# EAGLE design Pi-ic880a (EAGLE 8.4.2)
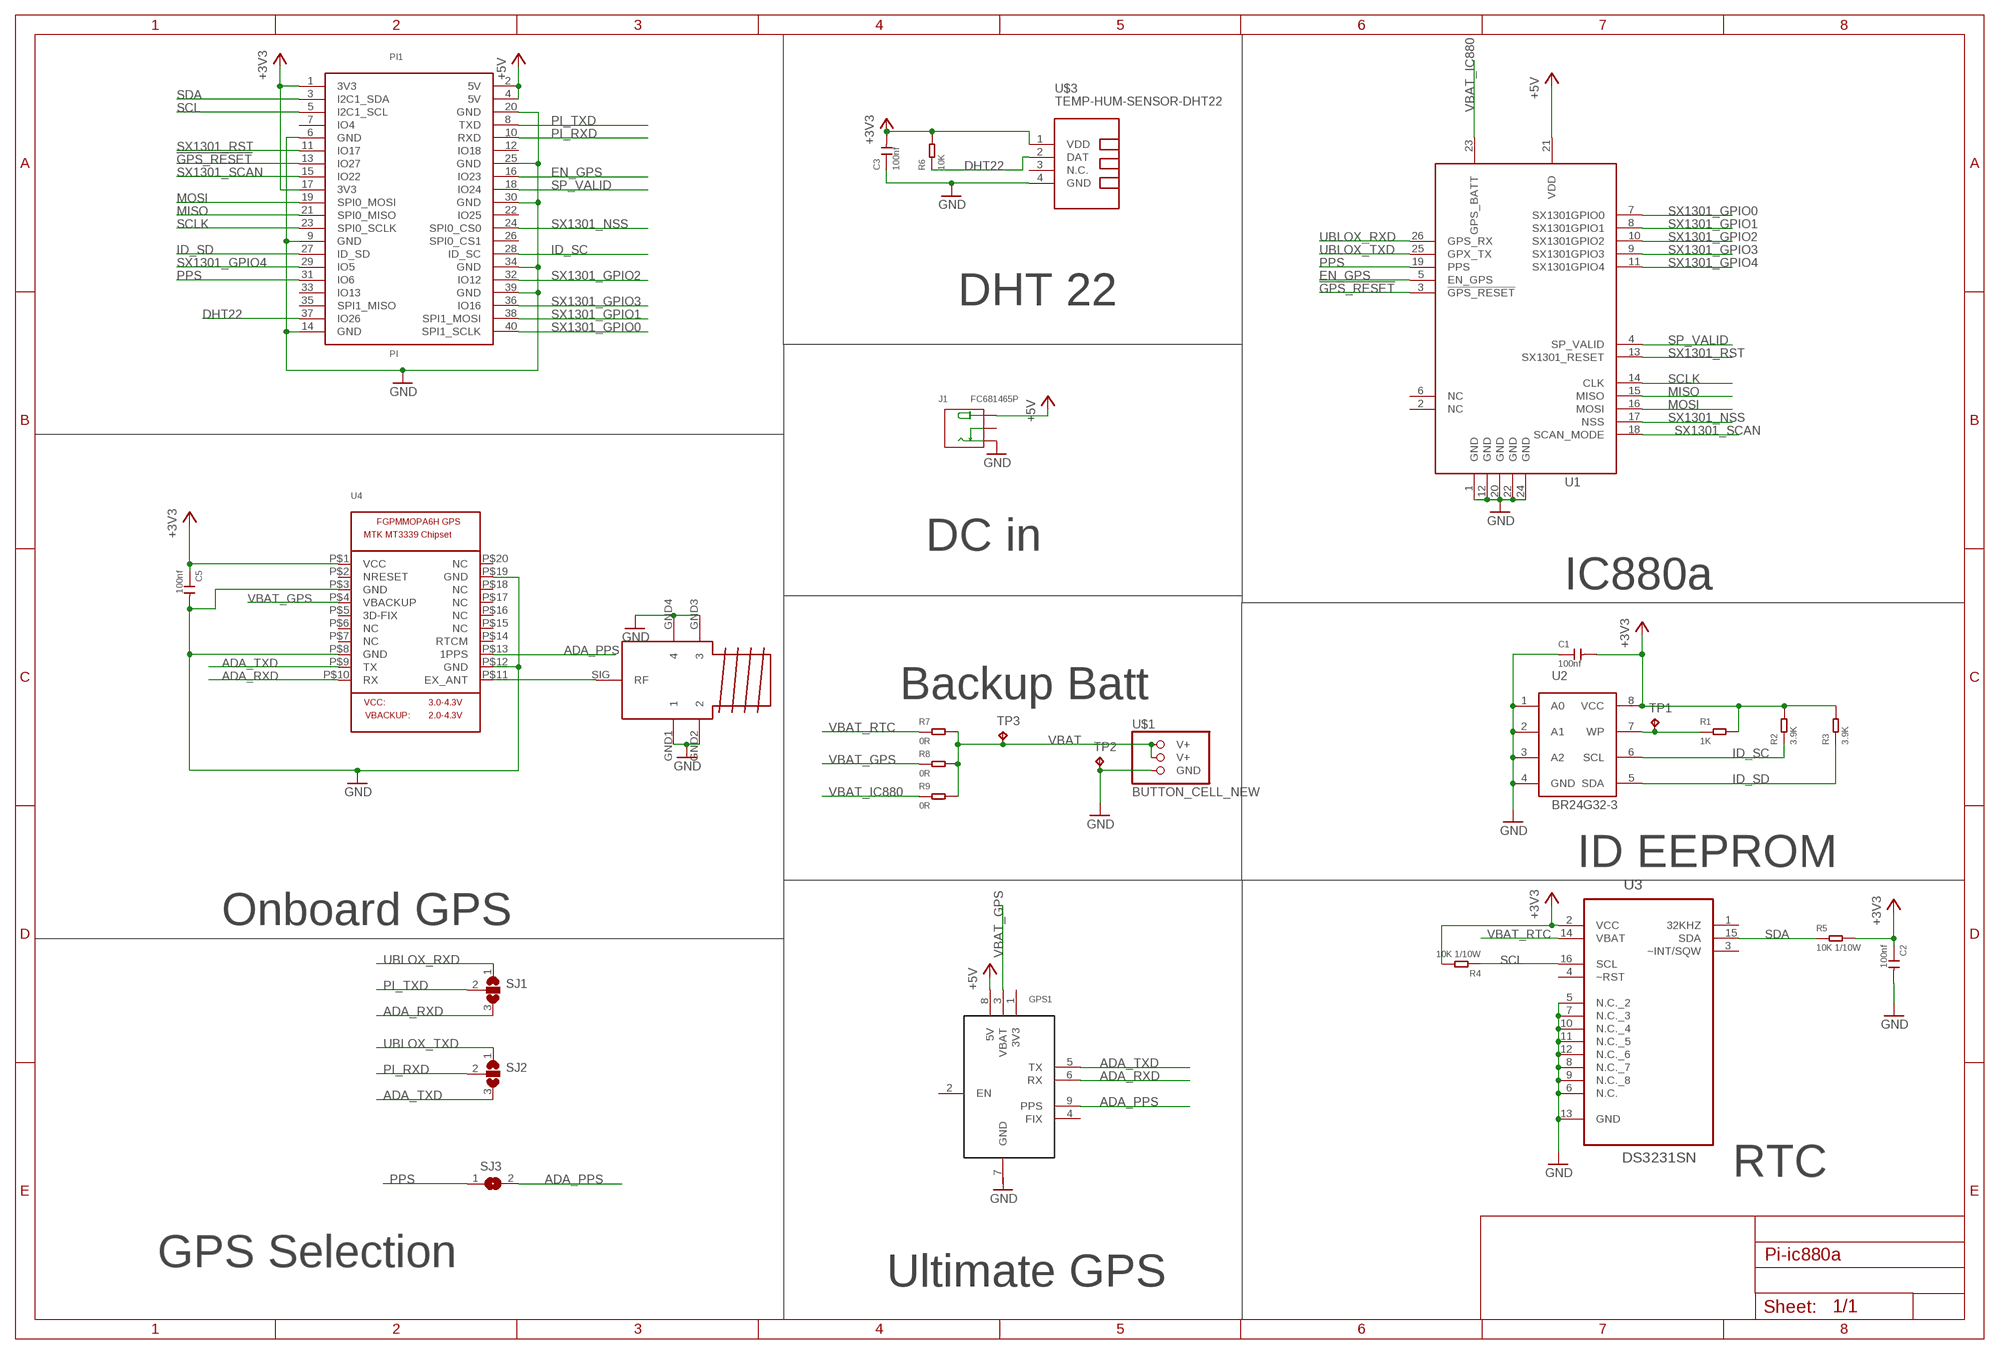
[diagram p0: schematic, sheet 1]

## Parts
C1  100nf  CERAMIC-100NF-50V-10%-X7R(0603)  [C0603]
C2  100nf  CERAMIC-100NF-50V-10%-X7R(0603)  [C0603]
C3  100nf  CERAMIC-100PF-50V-5%-NPO(0603)  [C0603]
C5  100nf  CERAMIC-100NF-50V-10%-X7R(0603)  [C0603]
GPS1  ULTIMATE-GPS  [ULTIMATE-GPS]
J1  FC681465P  [FC681465P]
PI1  PI  [PI]
R1  1K  SMD-RES-1K-1%-1/10W(0603)  [R0603]
R2  3.9K  SMD-RES-3.9K-5%-1/10W(0603)  [R0603]
R3  3.9K  SMD-RES-3.9K-5%-1/10W(0603)  [R0603]
R4  10K 1/10W  SMD-RES-10K-5%-1/10W(0603)  [R0603]
R5  10K 1/10W  SMD-RES-10K-5%-1/10W(0603)  [R0603]
R6  10K  SMD-RES-10K-1%-1/10W(0603)  [R0603]
R7  0R  SMD-RES-0R-5%-1/10W(0603)  [R0603]
R8  0R  SMD-RES-0R-5%-1/10W(0603)  [R0603]
R9  0R  SMD-RES-0R-5%-1/10W(0603)  [R0603]
SJ1  SJ2W  [SJ_2]
SJ2  SJ2W  [SJ_2]
SJ3  SJ  [SJ]
TP1  TPB2,54  [B2,54]
TP2  TPB2,54  [B2,54]
TP3  TPB2,54  [B2,54]
U1  IC880A  [IC880A]
U2  BR24G32-3  [SOP8]
U3  DS3231SN  [SOIC127P1032X265-16N]
U4  GPS_FGPMMOPA6H  [FGPMMOPA6H]
U$1  BUTTON_CELL_NEW  [CR2016]
U$2  SMATH  [SMA]
U$3  TEMP-HUM-SENSOR-DHT22  [TEMP-HUM-SENSOR-DHT22]

## Nets
!GPS_RESET: PI1.13(IO27) U1.3(!GPS_RESET)
+3V3: C1.2 C2.1 C3.2 C5.1 PI1.1(3V3) PI1.17(3V3) R1.2 R2.2 R3.2 R4.2 R5.2 R6.2 U2.8(VCC) U3.2(VCC) U4.P$1(VCC) U$3.1(VDD)
+5V: GPS1.8(5V) J1.1(+) PI1.2(5V) PI1.4(5V) U1.21(VDD)
ADA_PPS: GPS1.9(PPS) SJ3.2 U4.P$13(1PPS)
ADA_RXD: GPS1.6(RX) SJ1.3 U4.P$10(RX)
ADA_TXD: GPS1.5(TX) SJ2.3 U4.P$9(TX)
DHT22: PI1.37(IO26) R6.1 U$3.2(DAT)
EN_GPS: PI1.16(IO23) U1.5(EN_GPS)
GND: C1.1 C2.2 C3.1 C5.2 J1.3(-) PI1.6(GND) PI1.9(GND) PI1.14(GND) PI1.20(GND) PI1.25(GND) PI1.30(GND) PI1.34(GND) PI1.39(GND) TP2.TP U1.1(GND) U1.12(GND) U1.20(GND) U1.22(GND) U1.24(GND) U2.1(A0) U2.2(A1) U2.3(A2) U2.4(GND) U3.5(N.C._2) U3.6(N.C.) U3.7(N.C._3) U3.8(N.C._7) U3.9(N.C._8) U3.10(N.C._4) U3.11(N.C._5) U3.12(N.C._6) U3.13(GND) U4.P$3(GND) U4.P$8(GND) U4.P$12(GND) U4.P$19(GND) U$1.GND U$2.GND1 U$2.GND2 U$2.GND3 U$2.GND4 U$3.4(GND)
GPS_ANT: U4.P$11(EX_ANT) U$2.SIG(RF)
ID_SC: PI1.28(ID_SC) R2.1 U2.6(SCL)
ID_SD: PI1.27(ID_SD) R3.1 U2.5(SDA)
MISO: PI1.21(SPI0_MISO) U1.15(MISO)
MOSI: PI1.19(SPI0_MOSI) U1.16(MOSI)
PI_RXD: PI1.10(RXD) SJ2.2
PI_TXD: PI1.8(TXD) SJ1.2
PPS: PI1.31(IO6) SJ3.1 U1.19(PPS)
SCL: PI1.5(I2C1_SCL) R4.1 U3.16(SCL)
SCLK: PI1.23(SPI0_SCLK) U1.14(CLK)
SDA: PI1.3(I2C1_SDA) R5.1 U3.15(SDA)
SP_VALID: PI1.18(IO24) U1.4(SP_VALID)
SX1301_GPIO0: PI1.40(SPI1_SCLK) U1.7(SX1301GPIO0)
SX1301_GPIO1: PI1.38(SPI1_MOSI) U1.8(SX1301GPIO1)
SX1301_GPIO2: PI1.32(IO12) U1.10(SX1301GPIO2)
SX1301_GPIO3: PI1.36(IO16) U1.9(SX1301GPIO3)
SX1301_GPIO4: PI1.29(IO5) U1.11(SX1301GPIO4)
SX1301_NSS: PI1.24(SPI0_CS0) U1.17(NSS)
SX1301_RST: PI1.11(IO17) U1.13(SX1301_RESET)
SX1301_SCAN: PI1.15(IO22) U1.18(SCAN_MODE)
UBLOX_RXD: SJ1.1 U1.26(GPS_RX)
UBLOX_TXD: SJ2.1 U1.25(GPX_TX)
VBAT: R7.2 R8.2 R9.2 TP3.TP U$1.V+@1(V+) U$1.V+@2(V+)
VBAT_GPS: GPS1.3(VBAT) R8.1 U4.P$4(VBACKUP)
VBAT_IC880: R9.1 U1.23(GPS_BATT)
VBAT_RTC: R7.1 U3.14(VBAT)
WP: R1.1 TP1.TP U2.7(WP)
Unconnected: GPS1.2(EN) GPS1.4(FIX) J1.2(CDN) PI1.7(IO4) PI1.12(IO18) PI1.22(IO25) PI1.26(SPI0_CS1) PI1.33(IO13) PI1.35(SPI1_MISO) U1.2(NC) U1.6(NC) U3.1(32KHZ) U3.3(~INT/SQW) U3.4(~RST) U4.P$2(NRESET) U4.P$5(3D-FIX) U4.P$6(NC) U4.P$7(NC) U4.P$14(RTCM) U4.P$15(NC) U4.P$16(NC) U4.P$17(NC) U4.P$18(NC) U4.P$20(NC) U$3.3(N.C.)

## Notes on the sheet
- DHT 22
- DC in
- IC880a
- Backup Batt
- ID EEPROM
- Onboard GPS
- RTC
- GPS Selection
- Ultimate GPS

## Power pins joined to a net without a drawn wire
3V3: GPS1.1(3V3)
GND: GPS1.7(GND)

## Library data of the parts
C1 C2 C5 = Seeed-Capacitor-2016:CERAMIC-100NF-50V-10%-X7R(0603): 302010138; MPN: CC0603KRX7R9BB104
C3 = Seeed-Capacitor:CERAMIC-100PF-50V-5%-NPO(0603): 302010076; MPN: CC0603JRNPO9BN101; VALUE: 100pf
GPS1 = fruit-parts:ULTIMATE-GPS
J1 = farnell-parts:FC681465P
PI1 = fruit-parts:PI
R1 = Seeed-Resistor-2016:SMD-RES-1K-1%-1/10W(0603): 301010298; MPN: RC0603FR-071KL
R2 R3 = Seeed-Resistor-2016:SMD-RES-3.9K-5%-1/10W(0603): 301010101; MPN: RC0603JR-073K9L
R4 R5 = Seeed-Resistor-2016:SMD-RES-10K-5%-1/10W(0603): 301010293; MPN: RC0603JR-0710KL
R6 = Seeed-Resistor:SMD-RES-10K-1%-1/10W(0603): 301010299; MPN: RC0603FR-0710KL
R7-R9 = Seeed-Resistor:SMD-RES-0R-5%-1/10W(0603): 301010292; MPN: RC0603JR-070RL
SJ1 SJ2 = jumper:SJ2W: SMD solder JUMPER
SJ3 = jumper:SJ: SMD solder JUMPER
TP1-TP3 = testpad:TP: Test pad
U1 = fruit-parts:IC880A
U2 = farnell-parts:BR24G32-3: http://uk.farnell.com/rohm/br24g32fj-3gte2/serial-eeprom-32kbit-1mhz-sop/dp/2373743?MER=sy-me-pd-mi-alte
U3 = imported-parts:DS3231SN: Extremely Accurate I2C-Integrated RTC/TCXO/Crystal; MPN: DS3231SN#; OC_FARNELL: 1593292; OC_NEWARK: 68K3406; PACKAGE: SOIC-16; SUPPLIER: Maxim
U4 = fruit-parts:GPS_FGPMMOPA6H: GPS Module - MTK MT3339 Chipset, -165dBm sensitivity, 22 channels, 10Hz, auto-select external antenna options
U$1 = fruit-parts:BUTTON_CELL_NEW
U$2 = fruit-parts:SMA
U$3 = fruit-parts:TEMP-HUM-SENSOR-DHT22: DHT22 - digital humidity & temperature sensor Also known as: AM2302 AM2302 datasheet available here: http://akizukidenshi.com/download/ds/aosong/AM2302.pdf Click here to find device on ebay.com <http://www.ebay.com/sch/dht22+digital+sensor>

## Board
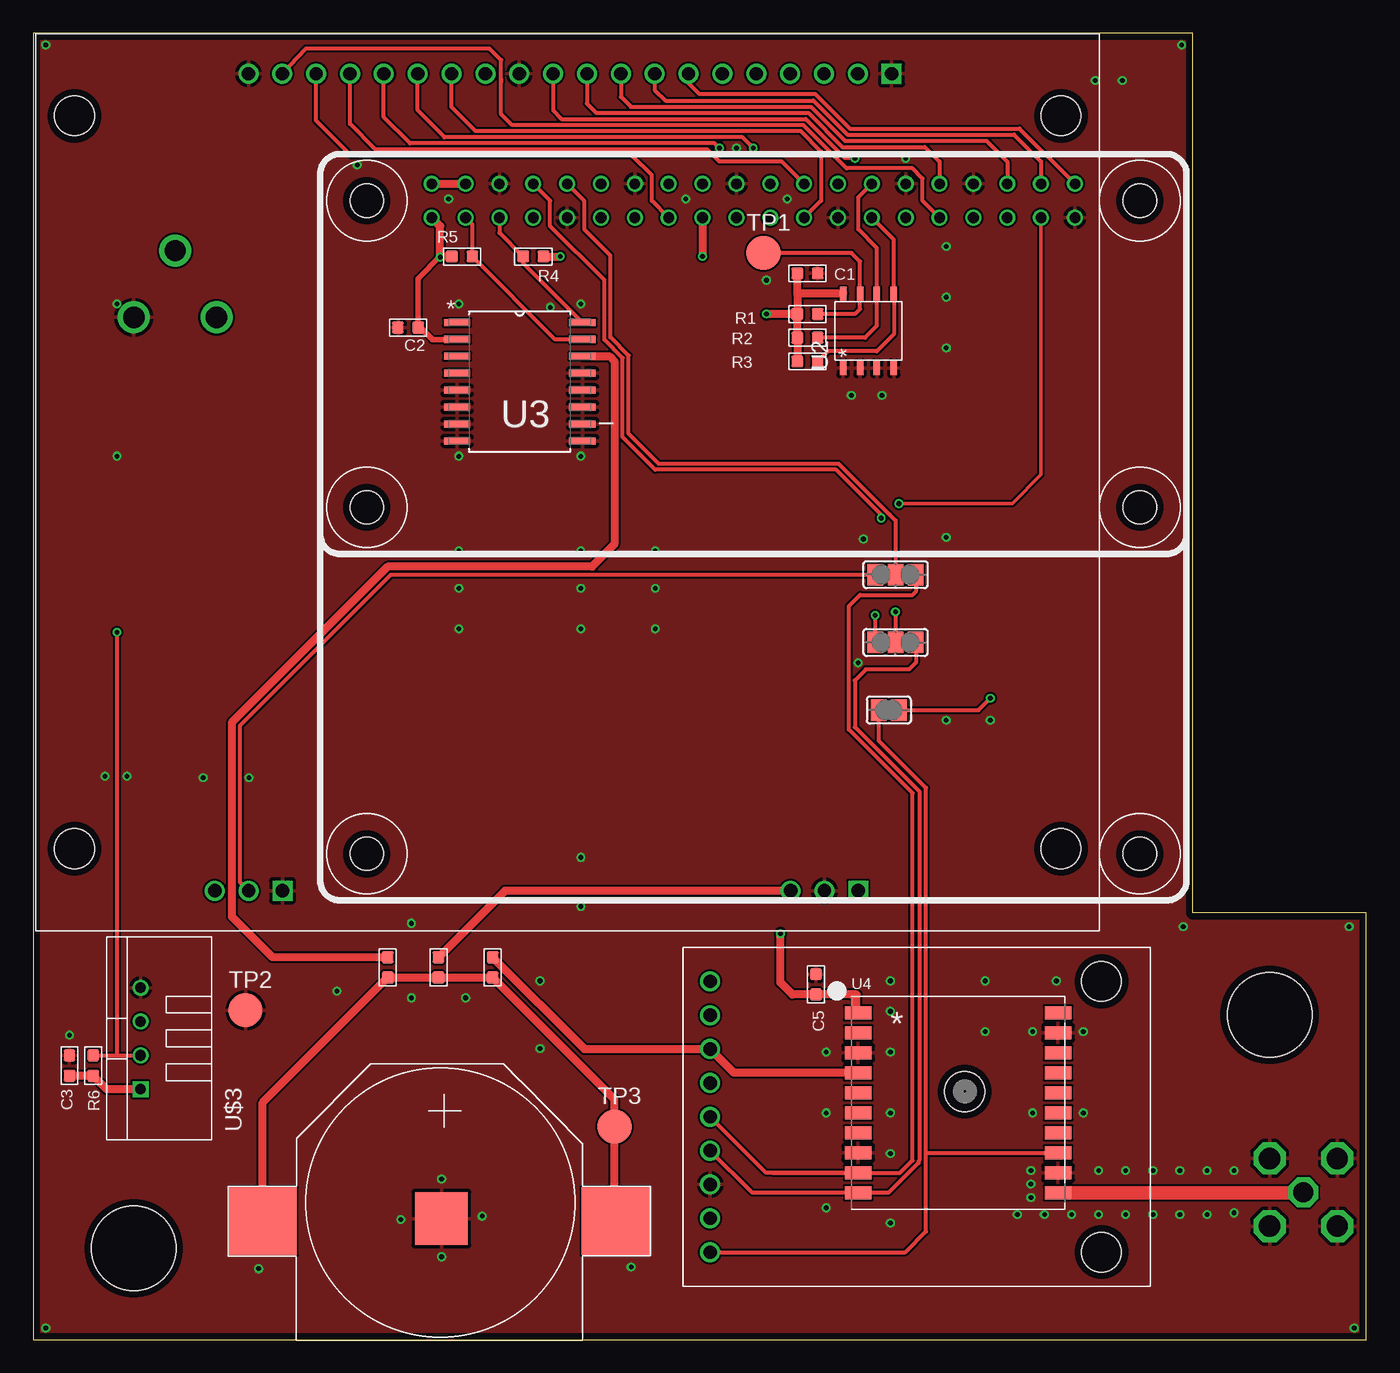
[diagram p1: board, top side]
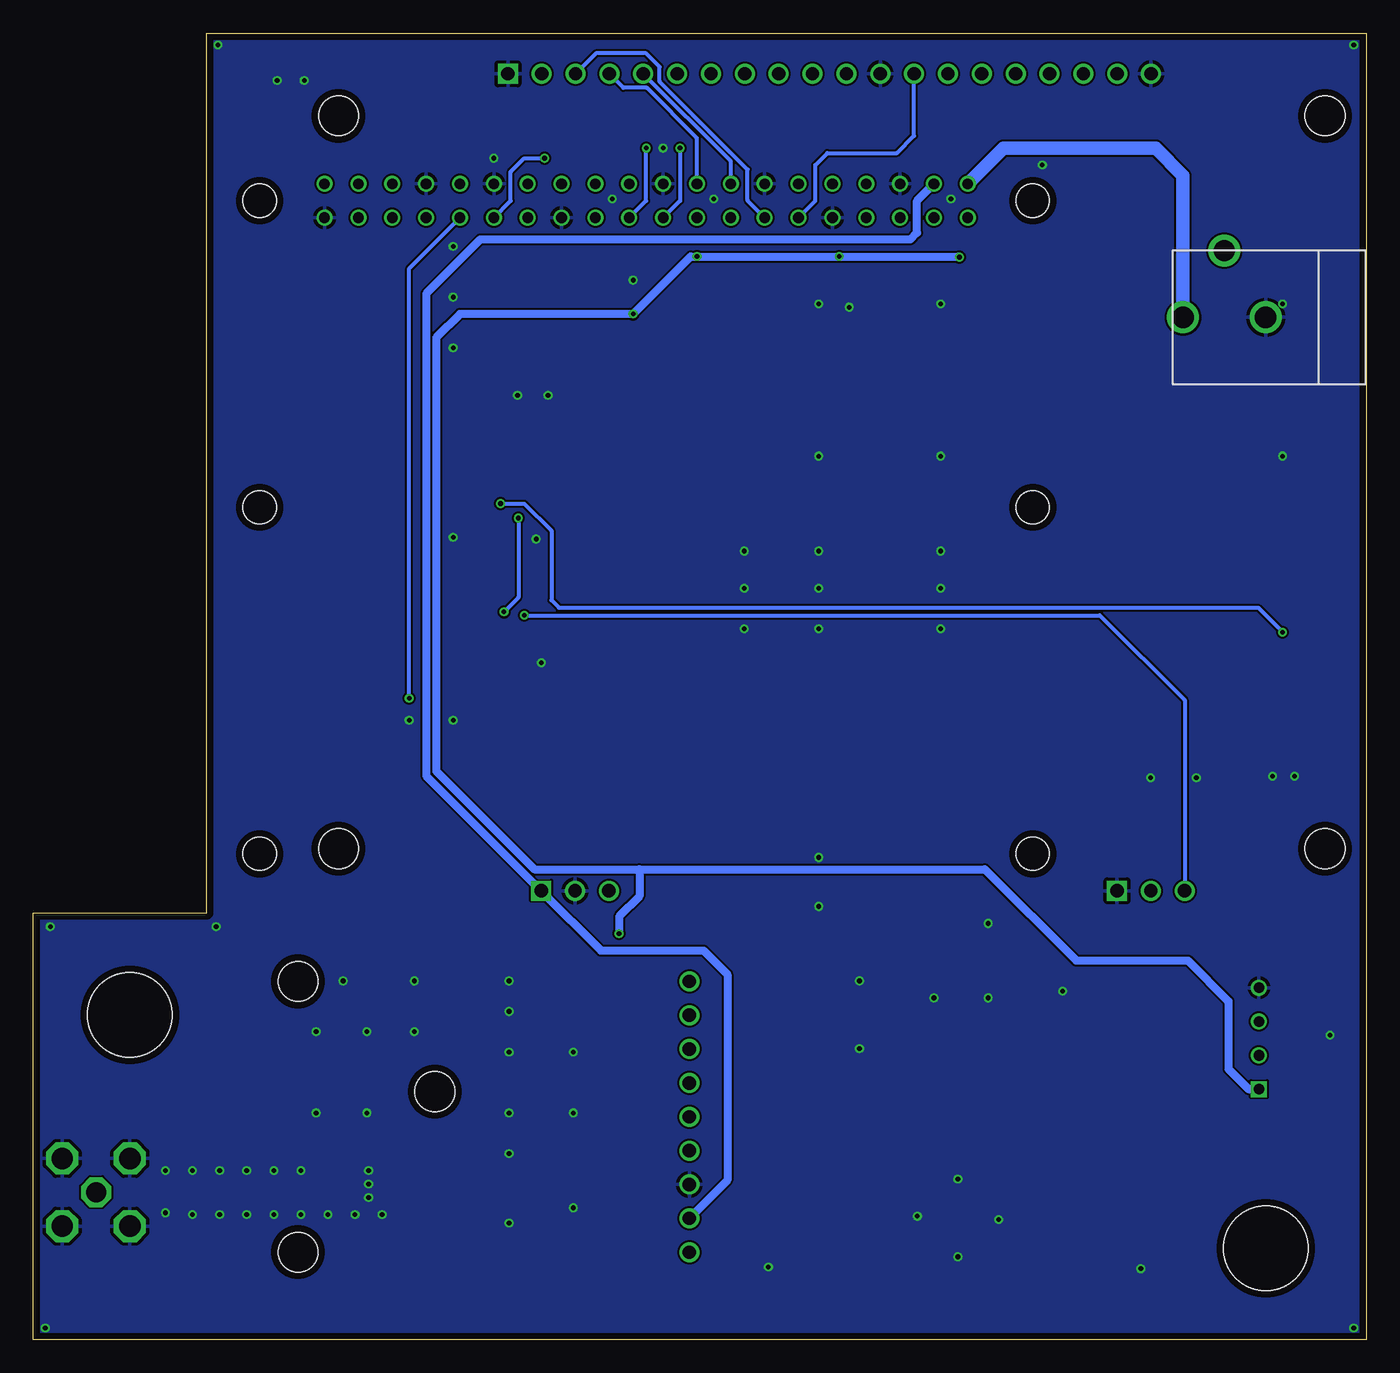
[diagram p2: board, bottom side, seen from below]

Size 100 x 98 mm. Coordinates in mm from the lower left corner, seen from the top.
Outline: 0,0 100,0 100,32 87,32 87,98 0,98 0,0
Copper layers (1*16): Top 0.035mm / dielectric 1.6mm / Bottom 0.035mm
Design rules "Elecrow_2-layer_PCB_eagle_rule": minimum track width 6mil, minimum drill 12mil, track to track 6mil, track to pad 6mil, pad to pad 6mil, via to via 8mil, smd to smd 0mil, copper to edge 20mil, drill to drill 10mil, minimum pad ring 6mil, minimum via ring 6mil, stop-mask expansion 0mil, vias tented up to drill 100mil, thermal gap 10mil
Holes 6.35 mm at 92.75,24.35 7.54,6.85

### Footprints (pad centres in the part's own frame; a part is rotated, then mirrored left to right if it is on the bottom)
C0603 = smd 0.889 x 0.889: 1 0,0.762; 2 0,-0.762
ULTIMATE-GPS = drill 1: 1 -10.16,-15.494; 2 -7.62,-15.494; 3 -5.08,-15.494; 4 -2.54,-15.494; 5 0,-15.494; 6 2.54,-15.494; 7 5.08,-15.494; 8 7.62,-15.494; 9 10.16,-15.494 | hole 3: -10.16,13.858; 10.16,13.858
FC681465P = drill 1.6: 1 6.2,0; 2 3.1,-5; 3 0,0
PI = drill 0.8: 1 -24.13,23.23; 2 -24.13,25.77; 3 -21.59,23.23; 4 -21.59,25.77; 5 -19.05,23.23; 6 -19.05,25.77; 7 -16.51,23.23; 8 -16.51,25.77; 9 -13.97,23.23; 10 -13.97,25.77; 11 -11.43,23.23; 12 -11.43,25.77; 13 -8.89,23.23; 14 -8.89,25.77; 15 -6.35,23.23; 16 -6.35,25.77; 17 -3.81,23.23; 18 -3.81,25.77; 19 -1.27,23.23; 20 -1.27,25.77; 21 1.27,23.23; 22 1.27,25.77; 23 3.81,23.23; 24 3.81,25.77; 25 6.35,23.23; 26 6.35,25.77; 27 8.89,23.23; 28 8.89,25.77; 29 11.43,23.23; 30 11.43,25.77; 31 13.97,23.23; 32 13.97,25.77; 33 16.51,23.23; 34 16.51,25.77; 35 19.05,23.23; 36 19.05,25.77; 37 21.59,23.23; 38 21.59,25.77; 39 24.13,23.23; 40 24.13,25.77 | hole 2.5: -29,24.5; 29,24.5; -29,1.5; 29,1.5; -29,-24.5; 29,-24.5
R0603 = smd 0.889 x 0.889: 1 0,0.762; 2 0,-0.762
SJ_2 = smd 1.168 x 1.6: 1 -1.524,0; 2 0,0; 3 1.524,0
SJ = smd 1.168 x 1.6: 1 -0.762,0; 2 0.762,0
B2,54 = smd 2.54 x 2.54: TP 0,0
IC880A = drill 1 square: 1 -24.3,-30.65; 21 -21.8,30.65; 24 21.4,30.65 | drill 1: 2 -21.76,-30.65; 3 -19.22,-30.65; 4 -16.68,-30.65; 5 -14.14,-30.65; 6 -11.6,-30.65; 7 -9.06,-30.65; 8 -6.52,-30.65; 9 -3.98,-30.65; 10 -1.44,-30.65; 11 1.1,-30.65; 12 3.64,-30.65; 13 6.18,-30.65; 14 8.72,-30.65; 15 11.26,-30.65; 16 13.8,-30.65; 17 16.34,-30.65; 18 18.88,-30.65; 19 21.42,-30.65; 20 23.96,-30.65; 22 -19.26,30.65; 23 -16.72,30.65; 25 23.94,30.65; 26 26.48,30.65 | hole 3: -37,27.5; 37,27.5; -37,-27.5; 37,-27.5
SOP8 = smd 1 x 0.5: 1 -2.8,1.905; 2 -2.8,0.635; 3 -2.8,-0.635; 4 -2.8,-1.905; 5 2.8,-1.905; 6 2.8,-0.635; 7 2.8,0.635; 8 2.8,1.905
SOIC127P1032X265-16N = smd 1.981 x 0.533: 1 -4.699,4.445; 2 -4.699,3.175; 3 -4.699,1.905; 4 -4.699,0.635; 5 -4.699,-0.635; 6 -4.699,-1.905; 7 -4.699,-3.175; 8 -4.699,-4.445; 9 4.699,-4.445; 10 4.699,-3.175; 11 4.699,-1.905; 12 4.699,-0.635; 13 4.699,0.635; 14 4.699,1.905; 15 4.699,3.175; 16 4.699,4.445
FGPMMOPA6H = smd 2 x 1: P$1 -7.5,6.75; P$2 -7.5,5.25; P$3 -7.5,3.75; P$4 -7.5,2.25; P$5 -7.5,0.75; P$6 -7.5,-0.75; P$7 -7.5,-2.25; P$8 -7.5,-3.75; P$9 -7.5,-5.25; P$10 -7.5,-6.75; P$11 7.5,-6.75; P$12 7.5,-5.25; P$13 7.5,-3.75; P$14 7.5,-2.25; P$15 7.5,-0.75; P$16 7.5,0.75; P$17 7.5,2.25; P$18 7.5,3.75; P$19 7.5,5.25; P$20 7.5,6.75 | hole 3: 0.5,0.85
CR2016 = smd 3.962 x 3.962: GND -1.7,8.63 | smd 5.08 x 5.08: V+@1 -14.765,8.812; V+@2 11.7,8.83
SMA = drill 1.6 octagon: GND1 -2.54,2.54; GND2 2.54,2.54; GND3 2.54,-2.54; GND4 -2.54,-2.54 | drill 1.5 octagon: SIG 0,0
TEMP-HUM-SENSOR-DHT22 = drill 0.8 square: 1 -3.81,0 | drill 0.8: 2 -1.27,0; 3 1.27,0; 4 3.81,0

### Placement (x,y rotation side)
C1  58.08,79.99 270 top
C2  28.11,75.93 270 top
C3  2.71,20.55 0 top
C5  58.72,26.65 180 top
GPS1  66.28,16.71 270 top
J1  7.54,76.69 180 bottom
PI1  54.02,60.94 0 top
R1  58.08,76.94 270 top
R2  58.08,75.16 270 top
R3  58.08,73.39 270 top
R4  37.51,81.26 90 top
R5  32.18,81.26 270 top
R6  4.49,20.55 0 top
R7  26.59,27.92 0 top
R8  34.46,27.92 0 top
R9  30.4,27.92 0 top
SJ1  64.69,52.3 0 top
SJ2  64.69,57.38 0 top
SJ3  64.18,47.22 180 top
TP1  54.78,81.51 0 top
TP2  15.92,24.7 0 top
TP3  43.61,15.98 0 top
U1  40.1,64.31 180 top
U2  62.66,75.67 90 top
U3  36.49,71.86 0 top
U4  69.39,17.76 0 top
U$1  28.92,17.7 180 top
U$2  95.3,11.05 0 top
U$3  8.05,22.59 90 top

### Tracks (layer width: path | path; a pad name or v marks a point on that pad's centre or on a via)
!GPS_RESET
  Bottom 0.305: U1.3 57.78,96.5 54.02,96.5 53,95.48 53,94.38 46.41,87.78 46.41,85.45 PI1.13
+3V3  (via drill 0.35)
  Top 0.406: 28.87,76.11 C2.1 | 28.87,76.11 28.87,79.61 30.52,81.26 | U3.2 29.95,75.04 28.87,76.11
  Top 0.61: PI1.1 30.52,83.53 30.52,81.26 v30.52,81.21 30.58,81.26 R5.2 | R1.2 R2.2 R3.2 | R1.2 v55,76.94 | C3.2 R6.2 5.51,18.78 U$3.1 | R4.2 v39.54,81.26 | 57.32,78.47 R1.2 | 57.32,78.47 C1.2 | U2.8 57.33,78.47 57.32,78.47 | PI1.17 v50.21,81.26 | U4.P$1 61.77,24.63 61.77,25.89 C5.1 56.94,25.89 56.05,26.78 v56.05,30.46
  Bottom 0.61: v30.52,81.21 30.58,81.26 v39.54,81.26 v50.21,81.26 50.68,81.26 v55,76.94 67.99,76.94 69.77,75.16 69.77,42.65 62.4,35.29 54.53,35.29 | v56.05,30.46 56.05,31.73 54.53,33.25 54.53,35.29 | U$3.1 8.81,18.78 10.33,20.3 10.33,25.38 13.38,28.43 21.76,28.43 28.62,35.29 54.53,35.29
+5V
  Top 0.61: PI1.2 PI1.4
  Bottom 0.61: GPS1.8 47.92,11.95 47.92,27.41 49.7,29.19 57.42,29.19 U1.21 70.53,42.3 70.53,78.47 66.47,82.53 34.21,82.53 33.7,83.04 33.7,85.44 PI1.4
  Bottom 1.016: PI1.2 27.22,89.39 15.79,89.39 13.74,87.33 J1.1
ADA_PPS
  Top 0.305: SJ3.2 63.42,44.94 66.97,41.38 66.97,13.95 | 66.97,13.95 67.03,14.01 U4.P$13 | GPS1.9 65.42,6.55 66.97,8.11 66.97,13.95
ADA_RXD
  Top 0.305: SJ1.3 66.21,50.78 65.7,50.27 62.45,50.27 61.64,49.46 61.64,45.95 66.47,41.13 66.47,13.44 66.41,13.39 66.41,13.25 64.17,11.01 U4.P$10 53.94,11.01 GPS1.6
ADA_TXD
  Top 0.305: 55.46,12.51 U4.P$9 | SJ2.3 66.21,56.11 65.96,55.86 62.02,55.86 61.18,55.02 61.18,45.77 65.96,40.99 65.96,13.44 65.03,12.51 U4.P$9 | U4.P$9 54.98,12.51 GPS1.5
DHT22  (via drill 0.35)
  Top 0.254: PI1.37 75.61,64.88 73.45,62.72 v64.94,62.72
  Top 0.305: v6.27,53.07 6.27,21.32 | R6.1 6.27,21.32 | 6.27,21.32 U$3.2
  Bottom 0.305: v64.94,62.72 63.16,62.72 61.13,60.69 61.13,55.48 60.56,54.91 8.11,54.91 v6.27,53.07
EN_GPS
  Bottom 0.305: PI1.16 47.67,88.4 U1.5
GND  (via drill 0.35)
  other vias: 64.31,8.74 81.96,12.68 81.96,9.38 64.31,24.62 59.48,21.57 59.48,17 64.31,17 59.48,9.89 74.85,12.68 76.75,26.9 78.78,23.09 74.97,23.09 71.42,26.9 64.31,26.9 27.58,9 33.68,9.25 30.63,12.05 30.63,6.2 0.93,97.14 86.15,97.14 86.28,30.97 55,79.48 61.89,50.78 52.75,89.39 31.92,66.27 41.07,66.27 61.39,70.85 63.67,70.85 44.85,5.44 16.91,5.31 31.92,77.7 38.78,77.45 41.07,77.7 2.71,22.84 99.11,0.87 0.93,0.87 24.3,88.12 41.07,59.16 41.07,56.37 41.07,53.32 31.92,59.16 31.92,56.37 31.92,53.32 41.07,36.17 41.07,32.49 22.78,26.14 38.02,26.9 38.02,21.82 64.31,21.57 64.31,13.95 74.85,10.65 74.85,11.66 83.99,12.68 83.99,9.38 68.5,46.46 71.8,46.46 68.5,60.18 68.5,78.21 68.5,74.4 68.5,82.02 79.67,94.47 81.71,94.47 65.45,88.63 48.94,85.58 98.72,30.97 86.02,12.68 88.06,12.68 86.02,9.38 88.06,9.38 46.65,59.16 46.65,56.37 46.65,53.32 62.27,60.05 5.38,42.27 7.03,42.27 12.74,42.14 16.17,42.14 90.09,12.68 90.09,9.5 6.27,66.27 6.27,77.7 71.42,23.09 74.97,17 78.78,17 28.37,25.63 32.43,25.63 28.37,31.22 56.56,85.58 31.16,85.58 79.93,12.68 79.93,9.38 77.9,9.38 75.86,9.38 73.83,9.38
  pour Bottom: -4.15,104.12 91.1,104.12 91.61,34.27 91.61,33.76 104.57,33.76 104.57,-2.81 91.1,-2.81 -3.89,-2.81 -3.89,103.61
  pour Top: -3.13,101.07 89.07,101.07 88.82,32.49 103.3,32.49 103.3,-1.04 -3.13,-1.04
GPS_ANT
  Top 1.016: U4.P$11 95.26,11.01 U$2.SIG
ID_SC
  Top 0.305: R2.1 62.4,75.16 63.29,76.05 U2.6 63.29,81.9 61.89,83.29 61.89,85.69 PI1.28
ID_SD
  Top 0.305: PI1.27 64.56,82.52 U2.5 64.56,75.42 63.29,74.15 59.61,74.15 R3.1
MISO  (via drill 0.35)
  Top 0.305: v54.02,89.39 53.21,90.2 30.86,90.2 28.84,92.22 U1.15
  Bottom 0.305: v54.02,89.39 54.02,85.44 PI1.21
MOSI  (via drill 0.35)
  Top 0.305: v51.48,89.39 51.12,89.74 28.26,89.74 26.3,91.71 U1.16
  Bottom 0.305: v51.48,89.39 51.48,85.44 PI1.19
PI_RXD
  Top 0.305: SJ2.2 64.69,61.45 64.24,61.9 | 64.24,61.9 | 64.24,61.9 60.42,65.72 46.91,65.72 44.67,67.95 44.67,73.83 43.3,75.2 43.3,81.31 41.32,83.29 41.32,85.44 PI1.10
PI_TXD  (via drill 0.35)
  Top 0.305: v64.69,54.59 SJ1.2 | 63.61,61.73 v63.61,61.64 63.61,61.88 60.23,65.26 46.65,65.26 44.22,67.7 44.22,73.64 42.84,75.01 42.84,79.48 38.78,83.55 38.78,85.44 PI1.8
  Bottom 0.305: v63.61,61.64 63.61,55.67 v64.69,54.59
PPS  (via drill 0.35)
  Top 0.305: PI1.31 66.72,85.44 66.72,87.1 65.96,87.86 61.02,87.86 57.77,91.12 35.92,91.12 35.1,91.93 35.1,94.4 35.1,94.53 35.1,95.98 34.21,96.88 20.47,96.88 U1.19 | SJ3.1 70.91,47.22 v71.8,48.11
  Bottom 0.305: v71.8,48.11 71.8,80.36 PI1.31
SCL
  Top 0.305: PI1.5 34.97,83.04 R4.1 36.75,80.75 U3.16
SCLK
  Top 0.305: U1.14 31.38,92.47 33.19,90.66 57.58,90.66 59.1,89.13 59.1,85.44 PI1.23
SDA
  Top 0.305: PI1.3 32.94,83.66 R5.1 39.16,75.04 U3.15
SP_VALID
  Bottom 0.305: PI1.18 50.21,90.15 53.97,93.91 55.72,93.91 U1.4
SX1301_GPIO0
  Top 0.305: U1.7 49.16,94.25 49.96,93.45 58.66,93.45 61.25,90.86 74,90.86 PI1.40
SX1301_GPIO1
  Top 0.305: U1.8 46.62,93.74 47.42,92.94 58.52,92.94 61.06,90.4 73.58,90.4 75.61,88.37 PI1.38
SX1301_GPIO2
  Top 0.305: U1.10 41.54,92.73 42.23,92.03 58.14,92.03 60.7,89.47 66.89,89.47 67.99,88.37 PI1.32
SX1301_GPIO3
  Top 0.305: PI1.36 73.07,88.37 71.52,89.93 60.89,89.93 58.33,92.49 44.83,92.49 44.08,93.23 U1.9
SX1301_GPIO4  (via drill 0.35)
  Top 0.305: U1.11 39,92.22 39.64,91.57 57.95,91.57 60.89,88.64 61.63,88.64 v61.64,88.63
  Bottom 0.305: PI1.29 64.18,85.44 64.18,87.61 63.16,88.63 v61.64,88.63
SX1301_NSS
  Top 0.305: PI1.24 56.17,88.37 51.48,88.37 50.57,89.29 25.67,89.29 23.76,91.2 U1.17
SX1301_RST
  Bottom 0.305: PI1.11 41.32,85.44 41.32,88.12 40.43,89.01 35.22,89.01 33.92,90.31 U1.13
SX1301_SCAN
  Top 0.305: 35.35,88.83 44.93,88.83 46.4,87.36 46.4,85.44 PI1.15 | 35.35,88.83 | U1.18 21.22,91.46 23.84,88.83 35.35,88.83
UBLOX_RXD  (via drill 0.35)
  Top 0.305: SJ1.1 v63.16,54.34
  Bottom 0.305: U1.26 13.62,47.97 19.98,54.34 v63.16,54.34
UBLOX_TXD
  Top 0.305: SJ2.1 26.84,57.38 15.49,46.03 15.49,34.33 U1.25
VBAT
  Top 0.61: U$1.V+@1 43.58,11.15 43.61,11.15 TP3.TP 43.59,15.98 43.59,18.03 R8.2 R9.2 R7.2 17.22,17.79 U$1.V+@2
VBAT_GPS
  Top 0.61: U4.P$4 52.56,20.01 GPS1.3 41.35,21.79 R8.1
VBAT_IC880
  Top 0.61: U1.23 35.38,33.66 R9.1
VBAT_RTC
  Top 0.61: U3.14 43.23,73.77 43.61,73.39 43.61,59.67 41.93,57.99 26.59,57.99 14.88,46.29 14.88,31.75 | 14.88,31.75 14.9,31.73 | R7.1 17.95,28.68 14.88,31.75
WP
  Top 0.305: R1.1 61.64,76.94 62.02,77.32 U2.7 62.02,80.88 61.39,81.51 TP1.TP

### Text on the board
top_silk: Adafruit Ultimate GPS
silktop: EEPROM WP | V2.0 | TX | UBlox | Seperate | RX | UBlox | Seperate | PPS Link | Pi-CoT | RTC | UBX | GPS | Backup Batt | University of Southampton
silkbottom: - | + | 5V DC | University of Southampton